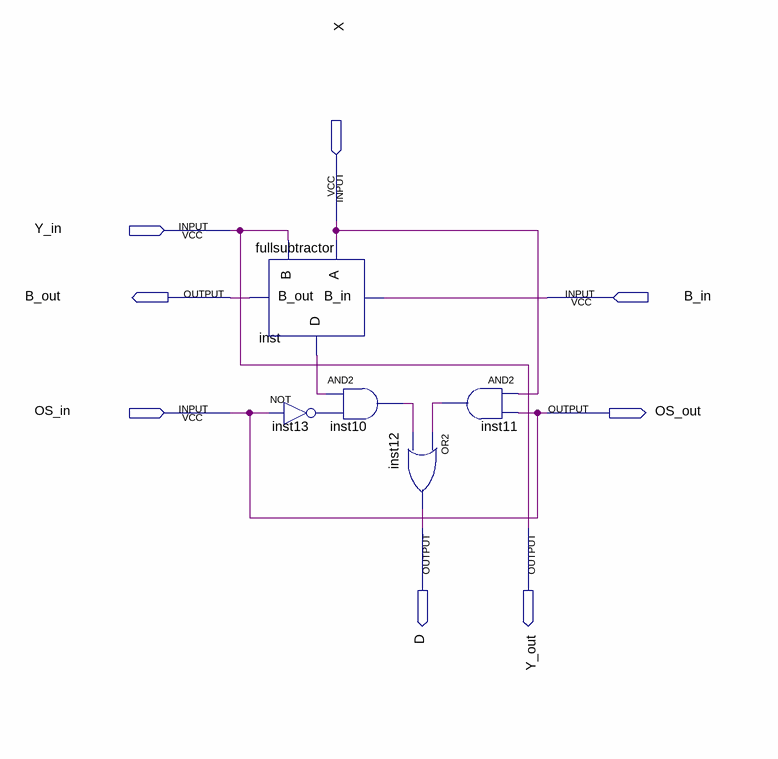
[diagram p0: schematic sheet]
// Quartus schematic celuladivisao.bdf as structural Verilog: 5 symbols, 8 pins
module celuladivisao (
  input  X,
  input  Y_in,
  input  B_in,
  input  OS_in,
  output B_out,
  output OS_out,
  output D,
  output Y_out
);

  wire inst10_out, inst11_out, inst13_out, inst_d;

  fullsubtractor inst (.A(X), .B(Y_in), .B_in(B_in), .D(inst_d), .B_out(B_out));
  not inst13 (inst13_out, OS_in);
  and inst10 (inst10_out, inst_d, inst13_out);
  or inst12 (D, inst11_out, inst10_out);
  and inst11 (inst11_out, X, OS_in);

  assign OS_out = OS_in;
  assign Y_out = Y_in;
endmodule
